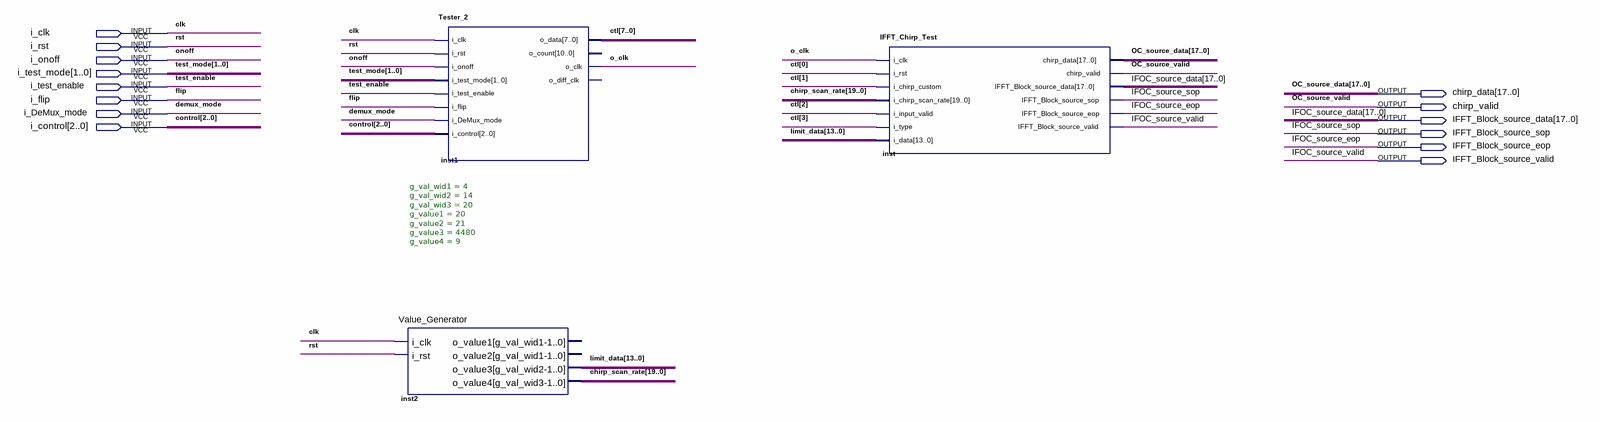
[diagram p0: schematic sheet]
// Quartus schematic IFFT_Chirp_ExTest.bdf as structural Verilog: 3 symbols, 14 pins
module IFFT_Chirp_ExTest (
  input  i_clk,
  input  i_rst,
  input  i_onoff,
  input  [1:0] i_test_mode,
  input  i_test_enable,
  input  i_flip,
  input  i_DeMux_mode,
  input  [2:0] i_control,
  output [17:0] chirp_data,
  output chirp_valid,
  output [17:0] IFFT_Block_source_data,
  output IFFT_Block_source_sop,
  output IFFT_Block_source_eop,
  output IFFT_Block_source_valid
);

  wire o_clk;
  wire [7:0] ctl;
  wire [13:0] limit_data;
  wire [19:0] chirp_scan_rate;

  Value_Generator #(.g_val_wid1(4), .g_val_wid2(14), .g_val_wid3(20), .g_value1(20), .g_value2(21), .g_value3(4480), .g_value4(9)) inst2 (
    .i_clk(i_clk), .i_rst(i_rst), .o_value3(limit_data), .o_value4(chirp_scan_rate));  // open: o_value1, o_value2
  Tester_2 inst1 (
    .i_clk(i_clk), .i_rst(i_rst), .i_onoff(i_onoff), .i_test_mode(i_test_mode),
    .i_test_enable(i_test_enable), .i_flip(i_flip), .i_DeMux_mode(i_DeMux_mode), .i_control(i_control),
    .o_data(ctl), .o_clk(o_clk));  // open: o_count, o_diff_clk
  IFFT_Chirp_Test inst (
    .i_clk(o_clk), .i_rst(ctl[0]), .i_chirp_custom(ctl[1]), .i_chirp_scan_rate(chirp_scan_rate),
    .i_input_valid(ctl[2]), .i_type(ctl[3]), .i_data(limit_data), .chirp_data(chirp_data),
    .chirp_valid(chirp_valid), .IFFT_Block_source_data(IFFT_Block_source_data),
    .IFFT_Block_source_sop(IFFT_Block_source_sop), .IFFT_Block_source_eop(IFFT_Block_source_eop),
    .IFFT_Block_source_valid(IFFT_Block_source_valid));

  // Other names for the same wires on the sheet: clk = i_clk; control[2:0] = i_control; demux_mode = i_DeMux_mode;
  //   flip = i_flip; IFOC_source_data[17:0] = IFFT_Block_source_data; IFOC_source_eop = IFFT_Block_source_eop;
  //   IFOC_source_sop = IFFT_Block_source_sop; IFOC_source_valid = IFFT_Block_source_valid;
  //   OC_source_data[17:0] = chirp_data; OC_source_valid = chirp_valid; onoff = i_onoff; rst = i_rst;
  //   test_enable = i_test_enable; test_mode[1:0] = i_test_mode
endmodule
